# Altium schematic sheet CAN Passthru Connector.SchDoc
size A4
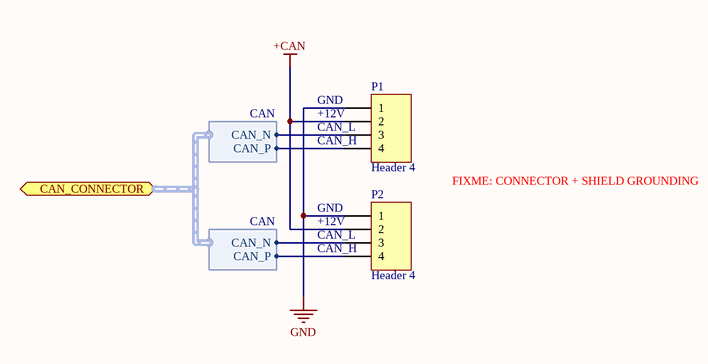
[diagram p0: CAN Passthru Connector.SchDoc]

## Parts
P1  Header 4  [HDR1X4]
P2  Header 4  [HDR1X4]

## Ports
CAN_CONNECTOR (harness CAN)

## Harnesses
CAN: CAN_N, CAN_P

## Nets
+CAN: P1.2 P2.2
GND: P1.1 P2.1
NetP1_3: P1.3 P2.3 ; port CAN_CONNECTOR.CAN_N
NetP1_4: P1.4 P2.4 ; port CAN_CONNECTOR.CAN_P

## Notes on the sheet
- (near P1) GND
- (near P1) +12V
- (near P1) CAN_L
- (near P1) CAN_H
- (near P2) GND
- (near P2) +12V
- FIXME: CONNECTOR + SHIELD GROUNDING
- (near P2) CAN_L
- (near P2) CAN_H

## Library data of the parts
P1 P2 = Header 4: Header, 4-Pin; LatestRevisionDate: 17-Jul-2002; LatestRevisionNote: Re-released for DXP Platform.; Publisher: Altium Limited